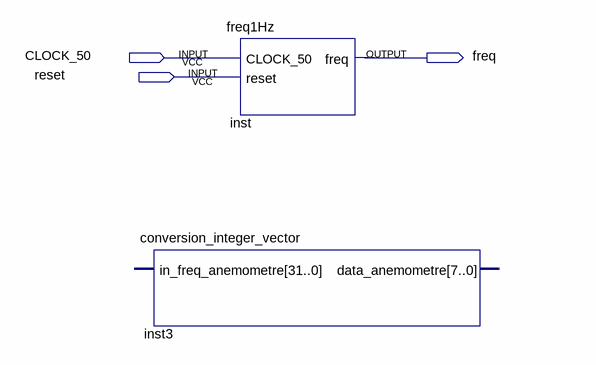
[diagram p0: schematic sheet]
// Quartus schematic gestion_anenometre.bdf as structural Verilog: 2 symbols, 3 pins
module gestion_anenometre (
  input  CLOCK_50,
  input  reset,
  output freq
);

  conversion_integer_vector inst3 ();  // open: in_freq_anemometre, data_anemometre
  freq1Hz inst (.CLOCK_50(CLOCK_50));  // open: reset, freq
endmodule
